# EAGLE design Xenon (EAGLE 8.0.1)
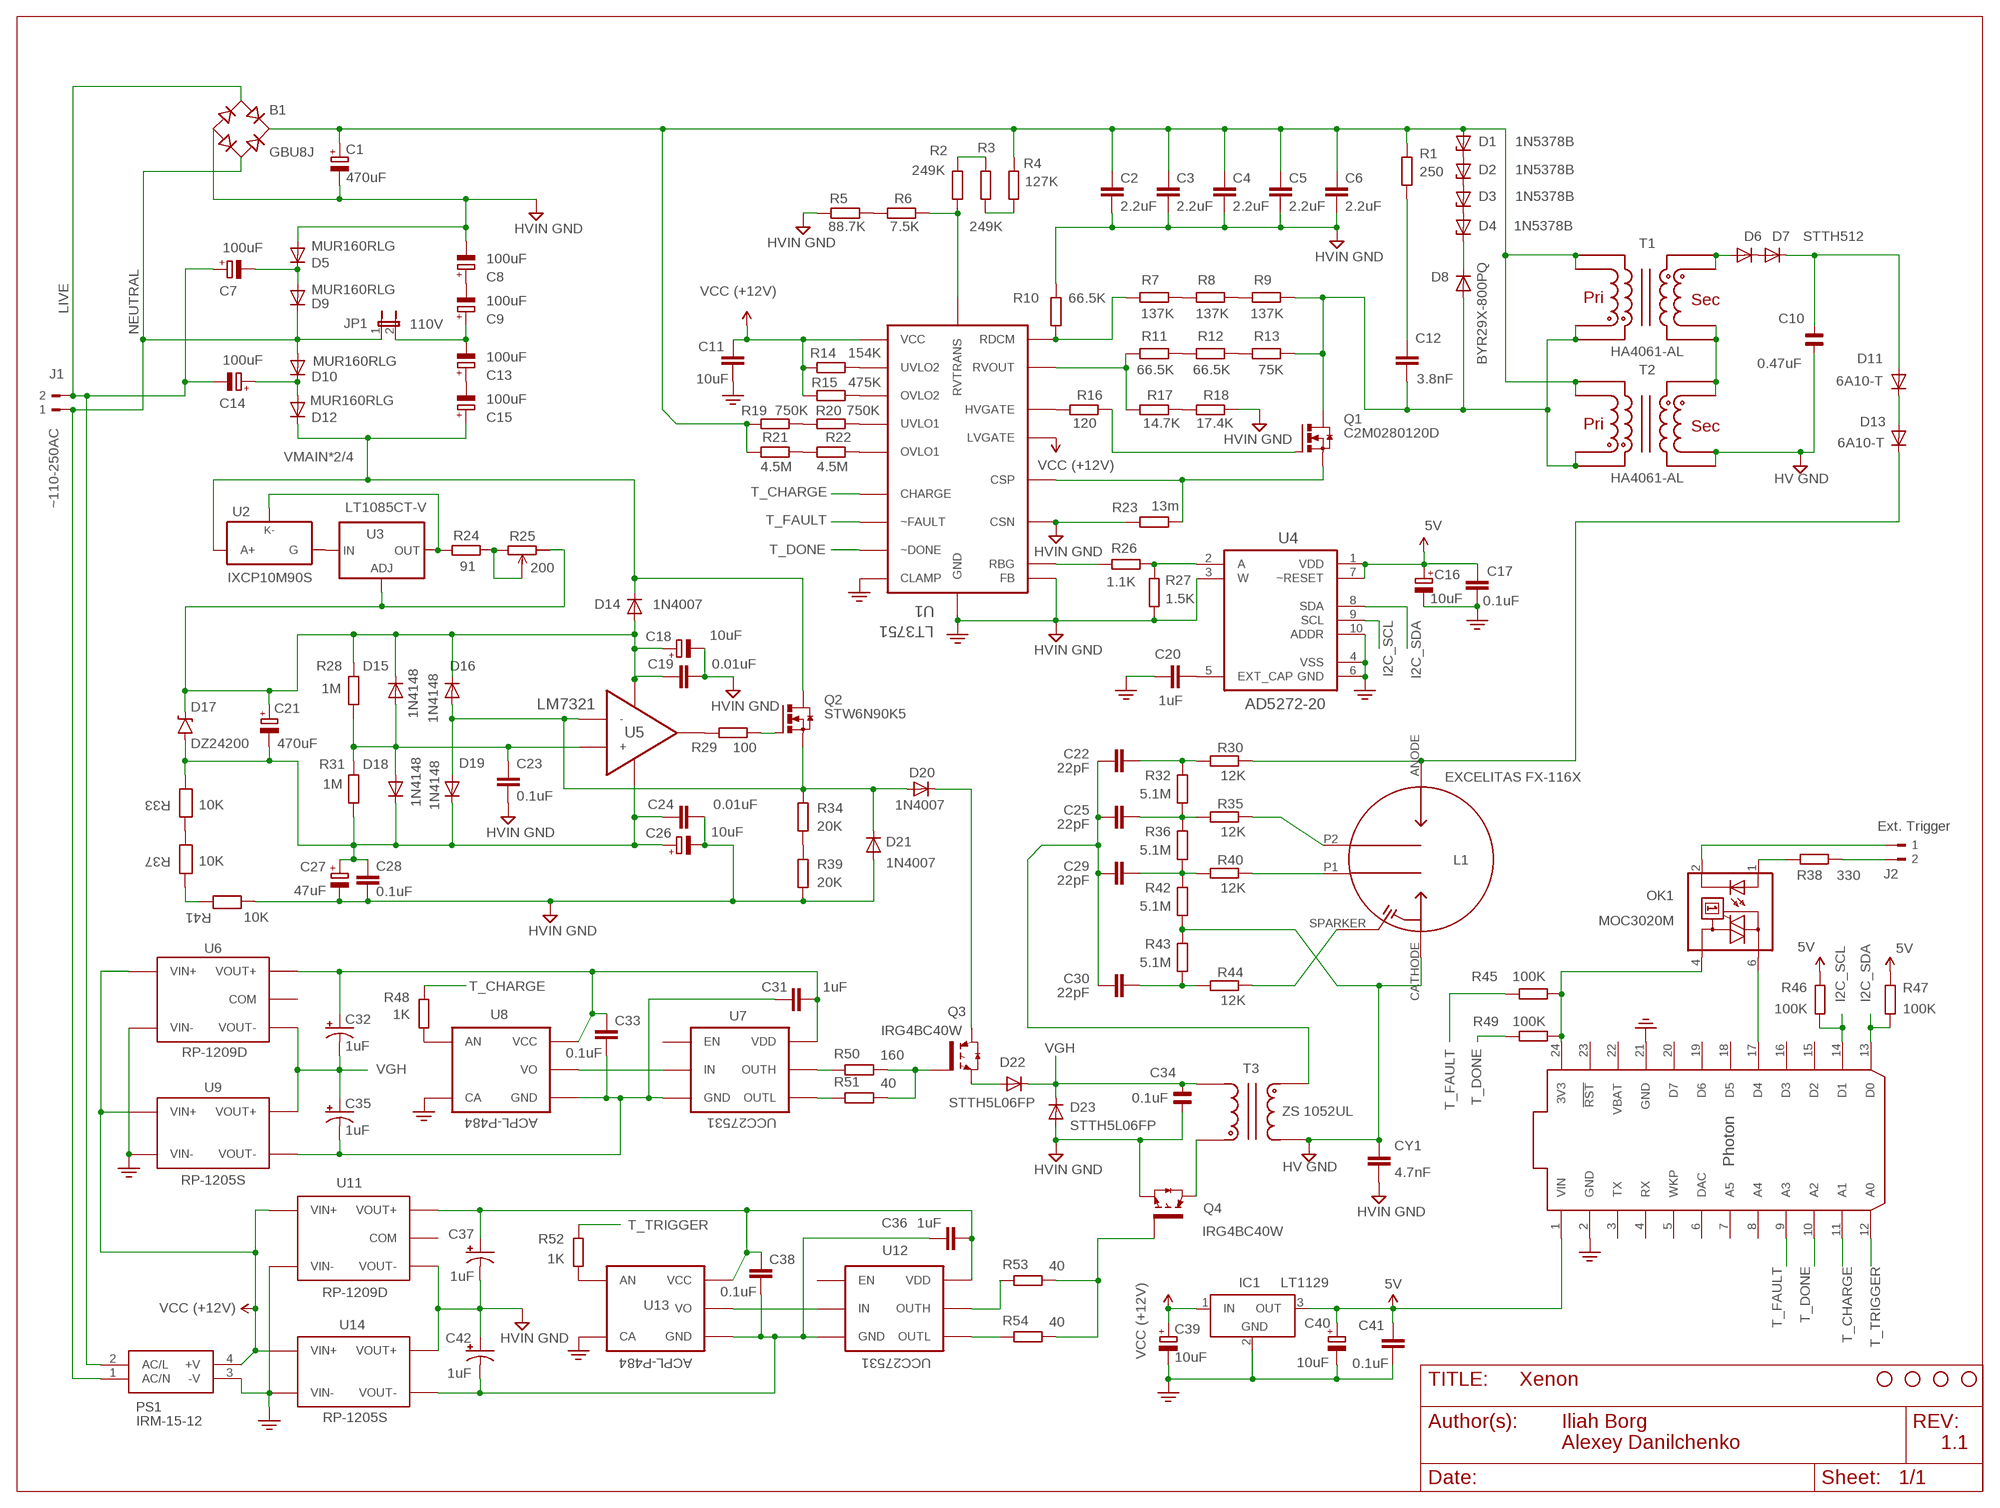
[diagram p0: schematic, sheet 1]

## Parts
B1  GBU8J  RECTIFIER-GBU4  [GBU4]
C1  470uF  CPOL-EUE10-35  [EB35D]
C2  2.2uF  C-EUC2220K  [C2220K]
C3  2.2uF  C-EUC2220K  [C2220K]
C4  2.2uF  C-EUC2220K  [C2220K]
C5  2.2uF  C-EUC2220K  [C2220K]
C6  2.2uF  C-EUC2220K  [C2220K]
C7  100uF  CPOL-EUE7.5-18  [E7,5-18]
C8  100uF  CPOL-EUE7.5-18  [E7,5-18]
C9  100uF  CPOL-EUE7.5-18  [E7,5-18]
C10  0.47uF  0,47µF  [R37K5B19]
C11  10uF  C-EUC0805  [C0805]
C12  3.8nF  C-EUC0805  [C0805]
C13  100uF  CPOL-EUE7.5-18  [E7,5-18]
C14  100uF  CPOL-EUE7.5-18  [E7,5-18]
C15  100uF  CPOL-EUE7.5-18  [E7,5-18]
C16  10uF  CPOL-EUCT3216  [CT3216]
C17  0.1uF  C-EUC0805  [C0805]
C18  10uF  CPOL-EUE5-10.5  [E5-10,5]
C19  0.01uF  C-EU050-035X075  [C050-035X075]
C20  1uF  C-EUC0805  [C0805]
C21  470uF  CPOL-EUG  [PANASONIC_G]
C22  22pF  C-EU050-030X075  [C050-030X075]
C23  0.1uF  C-EU050-035X075  [C050-035X075]
C24  0.01uF  C-EU050-035X075  [C050-035X075]
C25  22pF  C-EU050-030X075  [C050-030X075]
C26  10uF  CPOL-EUE5-10.5  [E5-10,5]
C27  47uF  CPOL-EUE5-10.5  [E5-10,5]
C28  0.1uF  C-EU050-035X075  [C050-035X075]
C29  22pF  C-EU050-030X075  [C050-030X075]
C30  22pF  C-EU050-030X075  [C050-030X075]
C31  1uF  C-EUC0805  [C0805]
C32  1uF  TANT-CAP1206  [EIA3216]
C33  0.1uF  C-EUC0805  [C0805]
C34  0.1uF  0,1µF  [R22K5B11]
C35  1uF  TANT-CAP1206  [EIA3216]
C36  1uF  C-EUC0805  [C0805]
C37  1uF  TANT-CAP1206  [EIA3216]
C38  0.1uF  C-EUC0805  [C0805]
C39  10uF  CPOL-EUCT7343  [CT7343]
C40  10uF  CPOL-EUCT7343  [CT7343]
C41  0.1uF  C-EUC0805  [C0805]
C42  1uF  TANT-CAP1206  [EIA3216]
CY1  4.7nF  CYYC10B4  [YC10B4]
D1  1N5378B  1N5333  [C1702-15]
D2  1N5378B  1N5333  [C1702-15]
D3  1N5378B  1N5333  [C1702-15]
D4  1N5378B  1N5333  [C1702-15]
D5  MUR160RLG  DIODE-DO41-10  [DO41-10]
D6  DIODE-TO220V  [TO220ACS]
D7  STTH512  DIODE-TO220V  [TO220ACS]
D8  BYR29X-800PQ  DIODE-TO220V  [TO220ACS]
D9  MUR160RLG  DIODE-DO41-10  [DO41-10]
D10  MUR160RLG  DIODE-DO41-10  [DO41-10]
D11  6A10-T  DIODE-P6-15  [P6-15]
D12  MUR160RLG  DIODE-DO41-10  [DO41-10]
D13  6A10-T  DIODE-P6-15  [P6-15]
D14  1N4007  DIODE-DO41-7.6  [DO41-7.6]
D15  1N4148  DIODE-SOD123  [SOD123]
D16  1N4148  DIODE-SOD123  [SOD123]
D17  DZ24200  DIODE-ZENERTMINIP2-F2-B  [PANASONIC_SMINI2-F5-B]
D18  1N4148  DIODE-SOD123  [SOD123]
D19  1N4148  DIODE-SOD123  [SOD123]
D20  1N4007  DIODE-DO41-7.6  [DO41-7.6]
D21  1N4007  DIODE-DO41-7.6  [DO41-7.6]
D22  STTH5L06FP  DIODE-TO220V  [TO220ACS]
D23  STTH5L06FP  DIODE-TO220V  [TO220ACS]
IC1  LT1129  LT1129CST5  [SOT223]
J1  ~110-250AC  PM5.08/2/90BLK  [WEIDMULLER_PM5.08_2]
J2  Ext. Trigger  PM5.08/2/90BLK  [WEIDMULLER_PM5.08_2]
JP1  110V  JP1E  [JP1]
L1  EXCELITAS FX-116X  EXCELITASFX-116X  [FX-116X]
OK1  MOC3020M  [DIL06]
PS1  IRM-15-12  [IRM-15-12]
Q1  C2M0280120D  IRFP240  [TO247BV]
Q2  STW6N90K5  IRFP240  [TO247BV]
Q3  IRG4BC40W  IRG4BC40WPBF  [TO220AV]
Q4  IRG4BC40W  IRG4BC40WPBF  [TO220AV]
R1  250  R-EU_R1206  [R1206]
R2  249K  R-EU_R1206  [R1206]
R3  249K  R-EU_R1206  [R1206]
R4  127K  R-EU_R1206  [R1206]
R5  88.7K  R-EU_R0805  [R0805]
R6  7.5K  R-EU_R0805  [R0805]
R7  137K  R-EU_R1206  [R1206]
R8  137K  R-EU_R1206  [R1206]
R9  137K  R-EU_R1206  [R1206]
R10  66.5K  R-EU_R0805  [R0805]
R11  66.5K  R-EU_R1206  [R1206]
R12  66.5K  R-EU_R1206  [R1206]
R13  75K  R-EU_R1206  [R1206]
R14  154K  R-EU_R0805  [R0805]
R15  475K  R-EU_R0805  [R0805]
R16  120  R-EU_R0805  [R0805]
R17  14.7K  R-EU_R0805  [R0805]
R18  17.4K  R-EU_R0805  [R0805]
R19  750K  R-EU_R1206  [R1206]
R20  750K  R-EU_R1206  [R1206]
R21  4.5M  R-EU_R1206  [R1206]
R22  4.5M  R-EU_R1206  [R1206]
R23  13m  R-EU_R1206  [R1206]
R24  91  R-EU_R1206  [R1206]
R25  200  R-TRIMMT93YA  [RTRIMT93YA]
R26  1.1K  R-EU_R0805  [R0805]
R27  1.5K  R-EU_R0805  [R0805]
R28  1M  R-EU_R1206  [R1206]
R29  100  R-EU_R1206  [R1206]
R30  12K  R-EU_0207/10  [0207/10]
R31  1M  R-EU_R1206  [R1206]
R32  5.1M  R-EU_0207/10  [0207/10]
R33  10K  WHE10KFET  [RES_WH/NE]
R34  20K  R-EU_0309/10  [0309/10]
R35  12K  R-EU_0207/10  [0207/10]
R36  5.1M  R-EU_0207/10  [0207/10]
R37  10K  WHE10KFET  [RES_WH/NE]
R38  330  R-EU_R0805  [R0805]
R39  20K  R-EU_0309/10  [0309/10]
R40  12K  R-EU_0207/10  [0207/10]
R41  10K  WHE10KFET  [RES_WH/NE]
R42  5.1M  R-EU_0207/10  [0207/10]
R43  5.1M  R-EU_0207/10  [0207/10]
R44  12K  R-EU_0207/10  [0207/10]
R45  100K  R-EU_R0805  [R0805]
R46  100K  R-EU_R0805  [R0805]
R47  100K  R-EU_R0805  [R0805]
R48  1K  R-EU_R1206  [R1206]
R49  100K  R-EU_R0805  [R0805]
R50  160  R-EU_R2512  [R2512]
R51  40  R-EU_R2512  [R2512]
R52  1K  R-EU_R1206  [R1206]
R53  40  R-EU_R2512  [R2512]
R54  40  R-EU_R2512  [R2512]
STANDOFF1  STAND-OFF  [STAND-OFF]
STANDOFF2  STAND-OFF  [STAND-OFF]
STANDOFF3  STAND-OFF  [STAND-OFF]
STANDOFF4  STAND-OFF  [STAND-OFF]
T1  HA4061-AL  [HA4061-AL]
T2  HA4061-AL  [HA4061-AL]
T3  ZS 1052UL  ZS1052H  [ZS1052H]
U1  LT3751  [SOP65P640X120-21N]
U2  IXCP10M90S  [TO254P482X1016X2386-3P]
U3  LT1085CT-V  [TO220S]
U4  AD5272-20  AD5272BRMZ-20  [SOP50P490X110-10N]
U5  LM7321  LM7321SOT23-5  [SOT95P280X145-5N]
U6  RP-1209D  RECOM-DUAL  [RECOM-DUAL]
U7  UCC27531  [SOT95P280X145-6N]
U8  ACPL-P484  [SOIC6-W]
U9  RP-1205S  RECOM-SINGLE  [RECOM-SINGLE]
U10  PHOTON_WITH_HEADERS  [PHOTON]
U11  RP-1209D  RECOM-DUAL  [RECOM-DUAL]
U12  UCC27531  [SOT95P280X145-6N]
U13  ACPL-P484  [SOIC6-W]
U14  RP-1205S  RECOM-SINGLE  [RECOM-SINGLE]

## Nets
5V: C16.-(+) C17.1 C40.+ C41.1 IC1.3(OUT) R46.2 R47.2 U4.1(VDD) U4.7(~RESET) U10.1(VIN)
GND: C11.2 C16.+(-) C17.2 C20.1 C39.- C40.- C41.2 IC1.2(GND) PS1.3(-V) R27.1 U1.9(CLAMP) U1.10(FB) U1.21(GND) U4.3(W) U4.4(VSS) U4.6(GND) U4.10(ADDR) U6.P$2(VIN-) U8.3(CA) U9.P$2(VIN-) U10.2(GND) U10.21(GND) U11.P$2(VIN-) U13.3(CA) U14.P$2(VIN-) ; supply symbol labelled HVIN GND
GND1: C10.2 CY1.1 L1.CATHODE R42.1 R43.2 T2.P5 T2.P6 T3.P3(S-S) ; supply symbol labelled HV GND
GND2: C18.- C19.2 C23.2 C24.2 C26.- C27.- C28.2 C34.2 C37.C(-) C42.A(+) CY1.2 D21.A D23.A Q4.3(E) R5.1 R18.2 R23.1 R39.1 R41.1 U1.11(CSN) U11.P$5(VOUT-) U14.P$7(VOUT+) ; supply symbol labelled HVIN GND
I2C_SCL: R46.1 U4.9(SCL) U10.14(D1)
I2C_SDA: R47.1 U4.8(SDA) U10.13(D0)
IGND1: C31.1 C33.2 C35.C(-) U7.4(GND) U8.4(GND) U9.P$5(VOUT-)
LIVE: B1.AC1 C7.+ C14.- J1.2 PS1.2(AC/L)
N$1: C10.1 D7.C D11.A
N$2: R5.2 R6.1
N$3: R50.1 U7.6(OUTH)
N$4: Q3.1(G) R50.2 R51.2
N$5: D13.C L1.ANODE R30.2
N$6: C12.2 D8.A Q1.D R9.2 R13.2 T1.P1 T1.P2 T2.P1 T2.P2
N$7: R51.1 U7.5(OUTL)
N$8: R54.1 U12.5(OUTL)
N$9: T1.P5 T1.P6 T2.P7 T2.P8
N$10: D6.A T1.P7 T1.P8
N$11: OK1.4(A1) R45.1 R49.1 U10.24(3V3)
N$12: R53.1 U12.6(OUTH)
N$13: Q4.1(G) R53.2 R54.2
N$14: U2.1(G) U3.3(IN)
N$15: L1.SPARKER R44.2
N$16: U12.2(IN) U13.5(VO)
N$17: D22.A Q3.3(E)
N$18: R52.1 U13.1(AN)
N$19: U7.2(IN) U8.5(VO)
N$20: C22.1 C25.1 C29.1 C30.1 T3.P4(S-P)
N$21: C36.1 C38.2 C42.C(-) U12.4(GND) U13.4(GND) U14.P$5(VOUT-)
N$22: C30.2 R43.1 R44.1
N$23: C29.2 R36.1 R40.1 R42.2
N$24: C25.2 R32.1 R35.1 R36.2
N$25: C22.2 R30.1 R32.2
N$26: L1.P2 R35.2
N$27: C31.2 C32.A(+) C33.1 U6.P$7(VOUT+) U7.3(VDD) U8.6(VCC)
N$28: L1.P1 R40.2
N$29: D6.C D7.A
N$30: OK1.1(A) R38.2
N$31: OK1.6(A2) U10.17(D4)
N$32: J2.2 R38.1
N$33: J2.1 OK1.2(C)
N$34: C36.2 C37.A(+) C38.1 U11.P$7(VOUT+) U12.3(VDD) U13.6(VCC)
N$35: Q4.2(C) T3.P2(P-P)
N$36: R48.1 U8.1(AN)
N$37: R24.1 U2.3(K-) U3.2(OUT)
N$38: R33.2 R37.1
N$39: R37.2 R41.2
N$40: C21.- C24.1 C26.+ C27.+ C28.1 D17.A D18.C D19.C R31.1 R33.1 U5.2(-VS)
N$41: C7.- D5.C D9.A
N$42: R24.2 R25.2(S) R25.3(A)
N$43: C23.1 D15.A D18.A R28.1 R31.2 U5.3(+)
N$44: D16.A D19.A D20.A D21.C Q2.S R34.2 U5.4(-)
N$45: R3.1 R4.1
N$46: R34.1 R39.2
N$47: R29.1 U5.1(VOUT)
N$48: Q2.G R29.2
N$49: R7.2 R8.1
N$52: R20.2 U1.2(UVLO1)
N$53: R19.2 R20.1
N$54: R22.2 U1.3(OVLO1)
N$55: R21.2 R22.1
N$56: B1.+ C1.+ C2.1 C3.1 C4.1 C5.1 C6.1 D1.A R1.2 R4.2 R19.1 R21.1 T1.P11 T1.P12 T2.P11 T2.P12
N$57: R14.2 U1.4(UVLO2)
N$58: R15.2 U1.5(OVLO2)
N$59: R2.2 R3.2
N$60: R2.1 R6.2 U1.1(RVTRANS)
N$61: Q1.S R23.2 U1.12(CSP)
N$62: R17.2 R18.1
N$63: R16.1 U1.15(HVGATE)
N$64: Q1.G R16.2
N$65: R7.1 R10.1 U1.20(RDCM)
N$66: R8.2 R9.1
N$67: R26.1 R27.2 U4.2(A)
N$68: R11.1 R17.1 U1.18(RVOUT)
N$69: R11.2 R12.1
N$70: R12.2 R13.1
N$71: C13.+ C15.-
N$72: C20.2 U4.5(EXT_CAP)
N$73: R26.2 U1.16(RBG)
N$74: C18.+ C19.1 C21.+ D14.A D15.C D16.C D17.C R25.1(E) R28.2 U3.1(ADJ) U5.5(+VS)
N$75: C14.+ D10.C D12.A
N$76: C9.+ C13.- JP1.2
N$77: C8.+ C9.-
N$78: D11.C D13.A
N$79: D1.C D2.A
N$80: D2.C D3.A
N$81: D3.C D4.A
N$82: D4.C D8.C
N$83: C12.1 R1.1
NEUTRAL: B1.AC2 D9.C D10.A J1.1 JP1.1 PS1.1(AC/N)
T_CHARGE: R48.2 U1.8(CHARGE) U10.11(A1)
T_DONE: R49.2 U1.7(~DONE) U10.10(A2)
T_FAULT: R45.2 U1.6(~FAULT) U10.9(A3)
T_TRIGGER: R52.2 U10.12(A0)
TR_GND: B1.- C1.- C2.2 C3.2 C4.2 C5.2 C6.2 C8.- D5.A R10.2 ; supply symbol labelled HVIN GND
VDD: C11.1 C39.+ IC1.1(IN) PS1.4(+V) R14.1 R15.1 U1.13(VCC) U1.14(LVGATE) U6.P$1(VIN+) U9.P$1(VIN+) U11.P$1(VIN+) U14.P$1(VIN+) ; supply symbol labelled VCC (+12V)
VGH: C32.C(-) C34.1 C35.A(+) D22.C D23.C T3.P1(P-S) U6.P$5(VOUT-) U9.P$7(VOUT+)
VMAIN*2/4: C15.+ D12.C D14.C Q2.D U2.2(A+)
VTRG: D20.C Q3.2(C)
Unconnected: U7.1(EN) U10.3(TX) U10.4(RX) U10.5(WKP) U10.6(DAC) U10.7(A5) U10.8(A4) U10.15(D2) U10.16(D3) U10.18(D5) U10.19(D6) U10.20(D7) U10.23(!RST) U12.1(EN)

## Notes on the sheet
- Iliah Borg
  Alexey Danilchenko
- 1.1

## Power pins joined to a net without a drawn wire
COM: U6.P$6(COM) U11.P$6(COM)
GND: IC1.4(GND)
VBAT: U10.22(VBAT)

## Library data of the parts
B1 = rectifier:RECTIFIER-: Rectifier
C1 C7-C9 C13-C15 C18 C21 C26 C27 = rcl:CPOL-EU: POLARIZED CAPACITOR, European symbol
C2-C6 C19 C22-C25 C28-C30 = rcl:C-EU: CAPACITOR, European symbol
C10 = Capacitor-Wima-MKP10-1600v:0,47µF
C11 C12 C31 C33 C36 C38 C41 = Spectron2:C-EU: CAPACITOR, European symbol
C16 = resistor:CPOL-EU: POLARIZED CAPACITOR, European symbol
C17 = resistor:C-EU: CAPACITOR, European symbol
C20 = Spectron:C-EU: CAPACITOR, European symbol
C32 C35 C37 C42 = Spectron2:TANT-CAP: Tantalum SMT
C34 = Capacitor-Wima-MKP10-1600v:0,1µF
C39 C40 = Spectron:CPOL-EU: POLARIZED CAPACITOR, European symbol
CY1 = rcl:CY: Y CAPACITOR for power line
D1-D4 = diode:1N5333: Z DIODE 3.3 V, 5W, 5 percent (Motorola)
D5-D7 D9-D16 D18-D21 = diode:DIODE-: DIODE
D8 D22 D23 = Spectron:DIODE-: DIODE
D17 = SparkFun-DiscreteSemi:DIODE-ZENER: Zener Diode Production Part - 8199 3.4V Zener Voltage; PROD_ID: DIO-12989
IC1 = linear-technology-3:LT1129CST5: VOLTAGE REGULATOR with shutdown
J1 J2 = WEIDMULLER-PM5.08_2_90BLK:PM5.08/2/90BLK: TERMINAL BLOCK, SIDE ENTRY, 2WAY; MPN: PM5.08/2/90 BLK; OC_FARNELL: 1131855; OC_NEWARK: 26M1980; PACKAGE: TH-R/A; SUPPLIER: WEIDMULLER
JP1 = jumper:JP1E: JUMPER
L1 = Xenon:EXCELITAS: Excelitas (Perkin Elmer) Xenon pulsed flash - FX-116x series
OK1 = optocoupler:MOC30*M: RANDOM-PHASE OPTOISOLATORS TRIAC DRIVER OUTPUT Source: http://www.fairchildsemi.com MOC3020-M.pdf; MF: FAIRCHILD SEMICONDUCTOR; MPN: MOC3020-M; OC_FARNELL: 1505425; OC_NEWARK: 72K8895
PS1 = IRM-15-12:IRM-15-12: AC/DC Power Modules 12V 1.25A 15W 85-264Vin Encap PS Source: Datasheet <https://www.meanwell-web.com/content/files/pdfs/productPdfs/MW/IRM-15-spec.pdf>; DESCRIPTION: AC/DC Power Modules 12V 1.25A 15W 85-264Vin Encap PS; HEIGHT: mm; MANUFACTURER_NAME: Mean Well; MANUFACTURER_PART_NUMBER: IRM-15-12; RS_PART_NUMBER: 1358936; RS_PRICE/STOCK: http://uk.rs-online.com/web/p/products/1358936
Q1 Q2 = transistor-power:IRFP240: HEXFET Power MosFet Source: http://www.irf.com/
Q3 Q4 = Xenon:IRG4BC40WPBF: INSULATED GATE BIPOLAR TRANSISTOR WITH ULTRAFAST SOFT RECOVERY DIODE
R1-R4 R7-R9 R11-R13 R19-R24 R28 R29 R31 R34 R39 R50 R51 R53 R54 = rcl:R-EU_: RESISTOR, European symbol
R5 R6 R10 R14-R18 R26 R27 R30 R32 R35 R36 R38 R40 R42-R47 R49 = resistor:R-EU_: RESISTOR, European symbol
R25 = rcl:R-TRIMM: Trimm resistor
R33 R37 R41 = Xenon:WHE10KFET; MANUFACTURER_PART_NUMBER: WHE10KFET; VENDOR: Ohmite
R48 R52 = Spectron2:R-EU_: RESISTOR, European symbol
STANDOFF1-STANDOFF4 = Spectron2:STAND-OFF: #4 Stand Off This is the mechanical footprint for a #4 phillips button head screw. Use the keepout ring to avoid running the screw head into surrounding components. SKU : PRT-00447
T1 T2 = Xenon:HA4061-AL
T3 = Xenon:ZS1052H
U1 = Xenon:LT3751: High Voltage Capacitor Charger Controller with Regulation; AVAILABILITY: Good; DESCRIPTION: LT3751 Capacitor Charge Control TSSOP-20; MF: Linear Technology; MP: LT3751EFE#PBF; PACKAGE: TSSOP-20 Linear Technology; PRICE: 5.83 USD
U2 = IXCP10M90S:IXCP10M90S: Current & Power Monitors & Regulators 900V 1-100mA Source: Datasheet <http://www.mouser.com/ds/2/205/98729-63438.pdf>; DESCRIPTION: Current & Power Monitors & Regulators 900V 1-100mA; HEIGHT: 4.82mm; MANUFACTURER_NAME: IXYS SEMICONDUCTOR; MANUFACTURER_PART_NUMBER: IXCP10M90S; SUPPLIER_NAME: RS
U3 = linear-technology-3:LT1085*: 3A Low Dropout Positive Adjustable Regulators
U4 = Analog Devices_By_element14_Batch_1:AD5272BRMZ-20: 1024-/256-Position, 1% Resistor Tolerance Error, I2C Interface and 50-TP Memory Digital Rheostat; MPN: AD5272BRMZ-20; OC_FARNELL: 1827322; OC_NEWARK: 52R8114; PACKAGE: MSOP-10; SUPPLIER: Analog Devices
U5 = Xenon:LM7321: Amplifiers; PACKAGE: SOT23-5
U6 U11 = Xenon:RECOM-DUAL: Recom Power RP series DC/DC isolated convertors
U7 U12 = Xenon:UCC27531: Single-channel, high-speed gate driver; PACKAGE: SOT-23-6; SUPPLIER: Texas Instruments
U8 U13 = Xenon:ACPL-P484: Single-channel, high-speed gate driver
U9 U14 = Xenon:RECOM-SINGLE: Recom Power RP series DC/DC isolated convertors
U10 = Spectron2:PHOTON

## Board
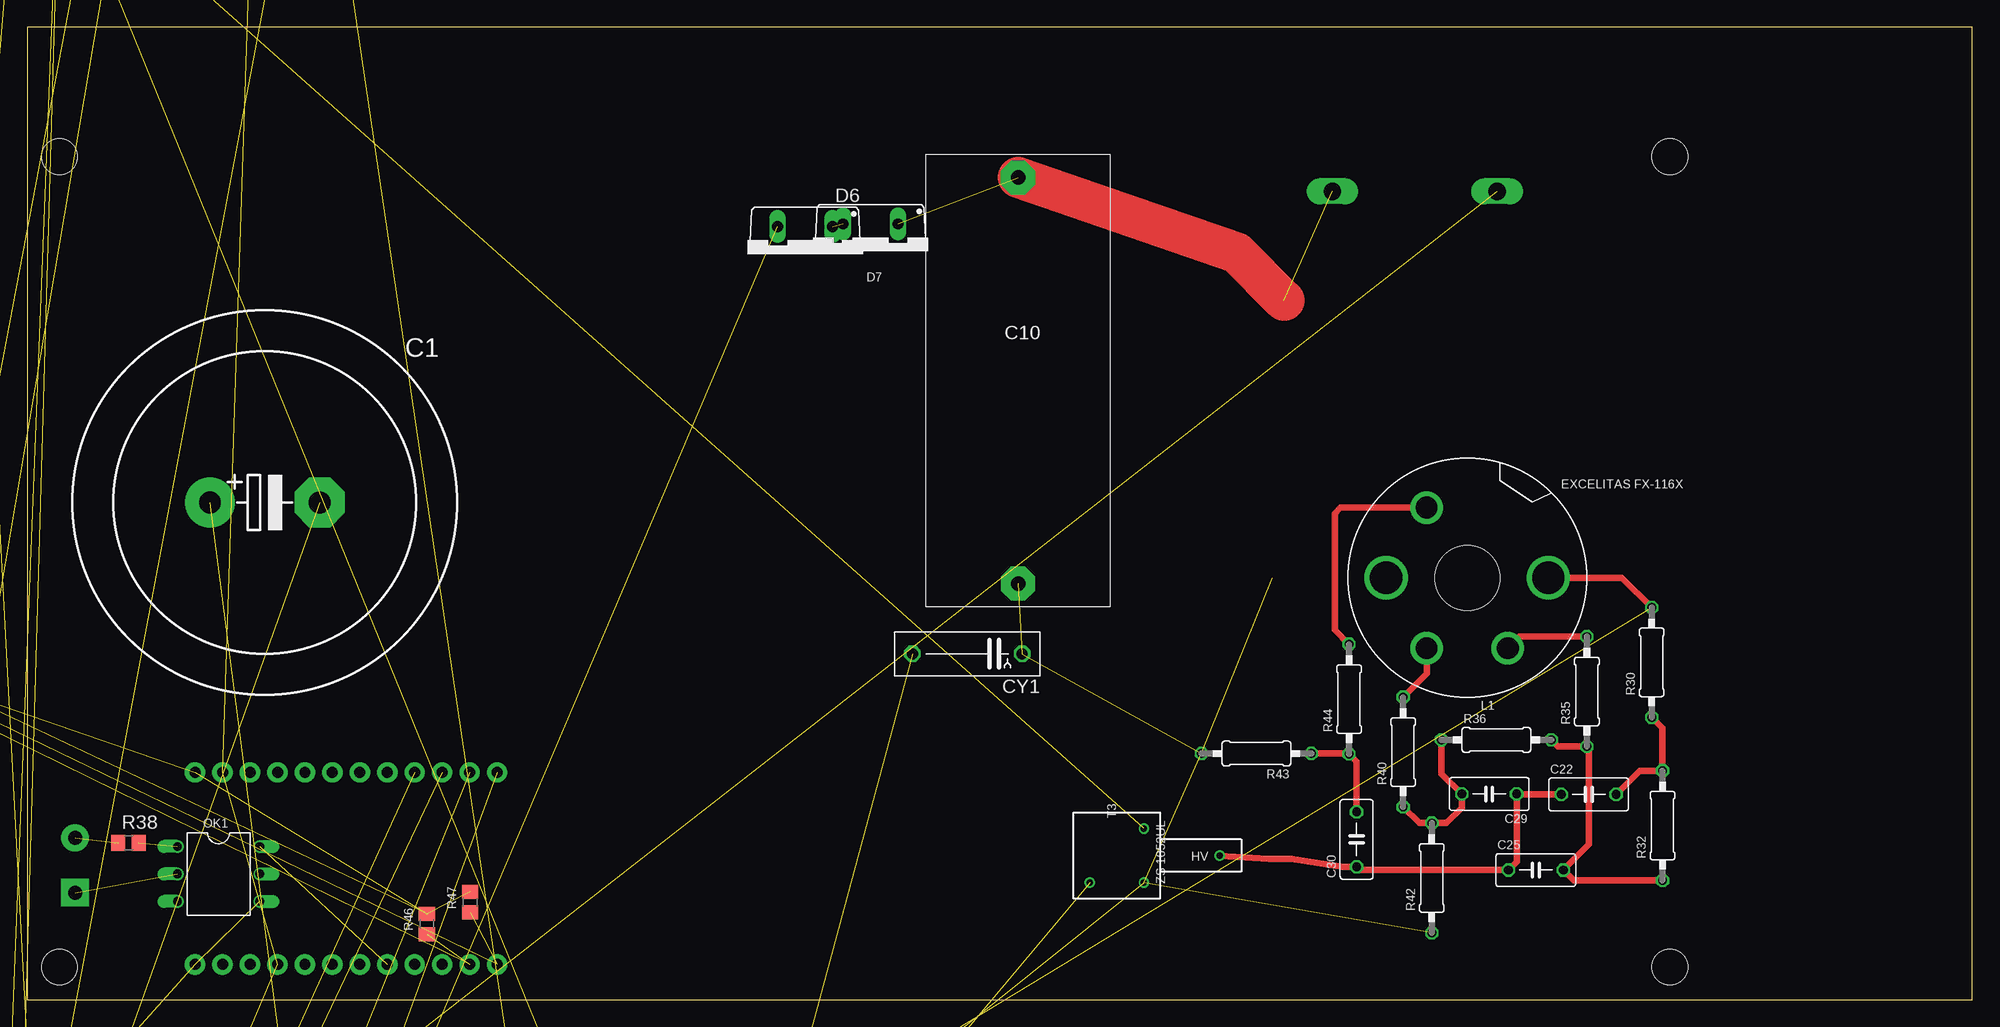
[diagram p1: board, top side]
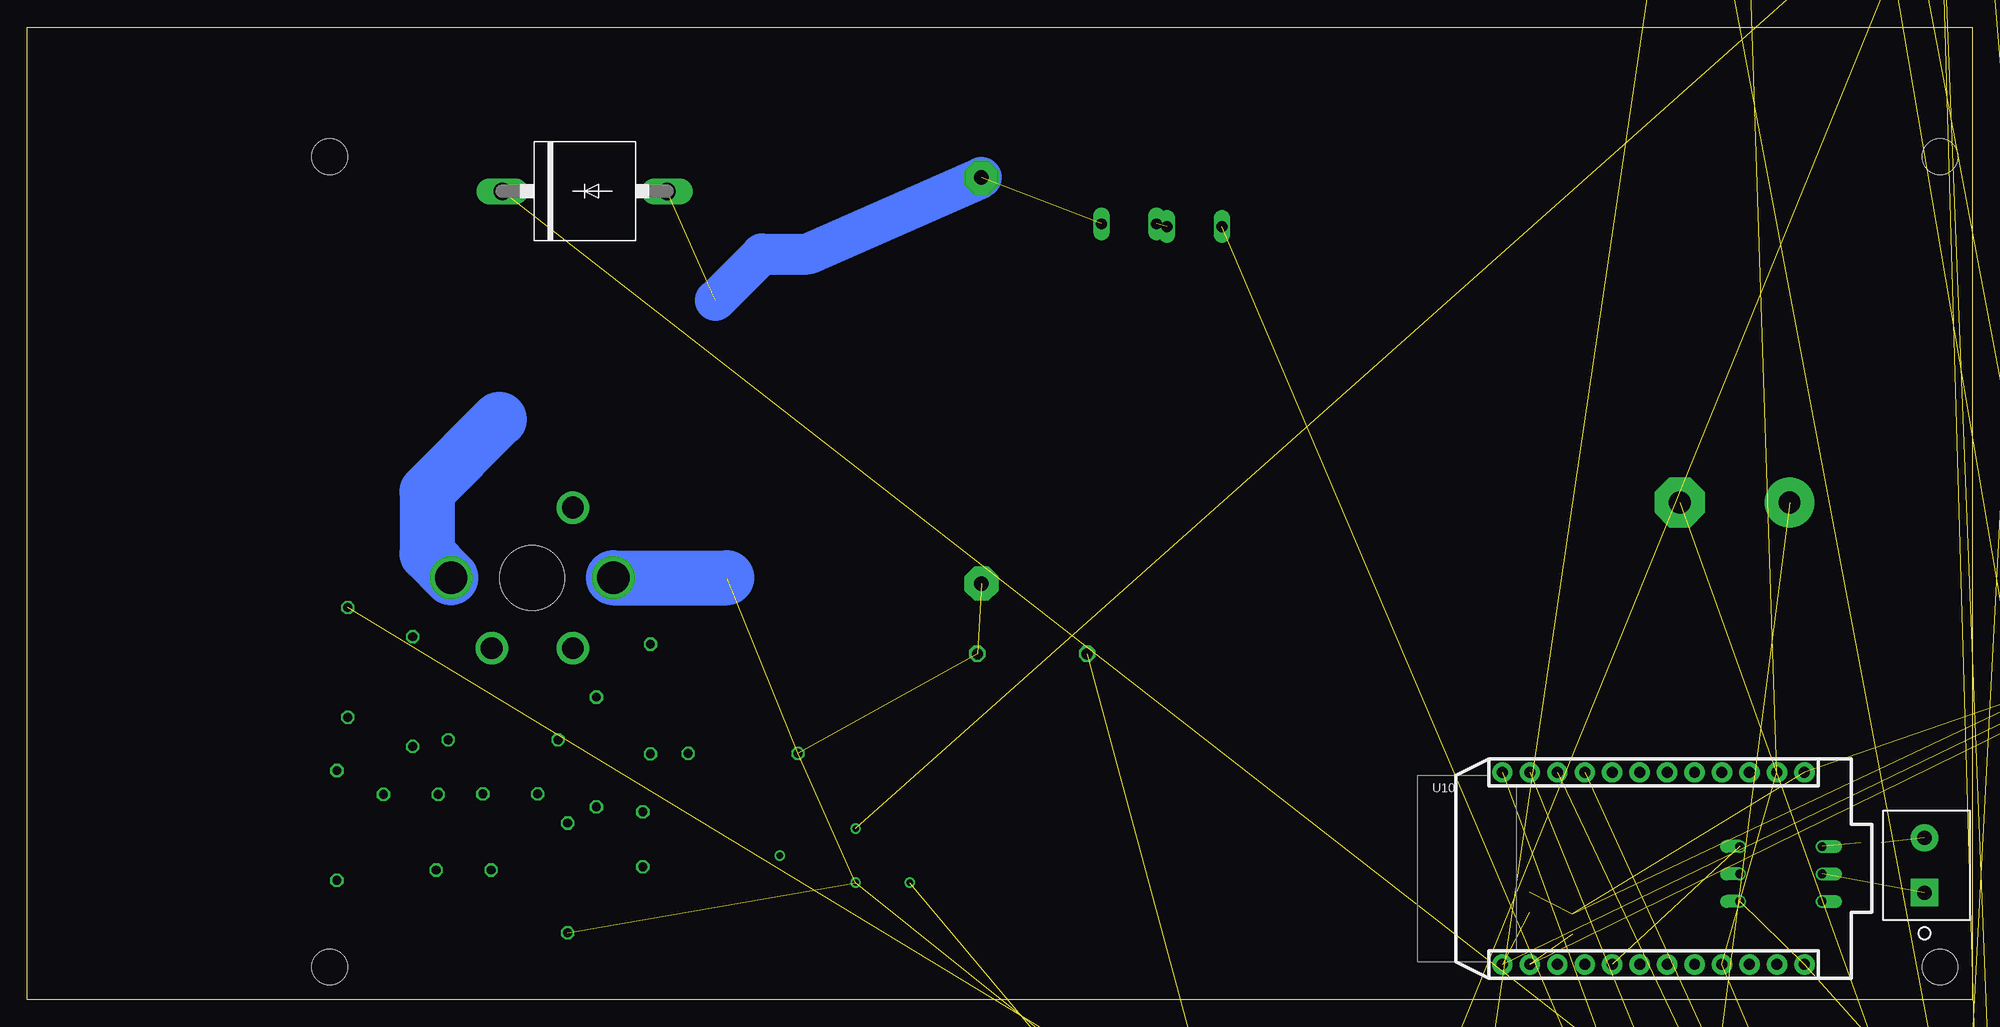
[diagram p2: board, bottom side, seen from below]

Size 180 x 90 mm. Coordinates in mm from the lower left corner, seen from the top.
Outline: 0,0 180,0 180,90 0,90 0,0
Copper layers (1*16): Top 0.0356mm / dielectric 1.5011mm / Bottom 0.0356mm
Design rules "oshpark-2layer *": minimum track width 6mil, minimum drill 13mil, track to track 8mil, track to pad 8mil, pad to pad 8mil, via to via 8mil, smd to smd 0mil, copper to edge 15mil, drill to drill 6mil, minimum pad ring 7mil, minimum via ring 7mil, stop-mask expansion 2.5mil, vias tented up to drill 0mil, thermal gap 10mil

### Footprints (pad centres in the part's own frame; a part is rotated, then mirrored left to right if it is on the bottom)
GBU4 = drill 1.499 long: + 7.62,0; - -7.62,0; AC1 2.54,0; AC2 -2.54,0
EB35D = drill 2.007 pad 4.597: + -5.08,0 | drill 2.007 pad 4.597 octagon: - 5.08,0
C2220K = smd 1.85 x 5.5: 1 -2.55,0; 2 2.55,0
E7,5-18 = drill 1.016 pad 3.15: + -3.81,0 | drill 1.016 pad 3.15 octagon: - 3.81,0
R37K5B19 = drill 1.321 pad 3.15 octagon: 1 -18.796,0; 2 18.796,0
C0805 = smd 1.3 x 1.5: 1 -0.95,0; 2 0.95,0
CT3216 = smd 2 x 1.2: + -1.4,0; - 1.4,0
E5-10,5 = drill 1.016 pad 2.54: + -2.54,0 | drill 1.016 pad 2.54 octagon: - 2.54,0
C050-035X075 = drill 0.813 octagon: 1 -2.54,0; 2 2.54,0
C0805' = smd 1.3 x 1.5: 1 -0.85,0; 2 0.85,0
PANASONIC_G = smd 3.9 x 1.6: + 4.25,0; - -4.25,0
C050-030X075 = drill 0.813 octagon: 1 -2.54,0; 2 2.54,0
EIA3216 = smd 1.4 x 1.6: A 1.4,0; C -1.4,0
R22K5B11 = drill 1.016 pad 2.54 octagon: 1 -11.303,0; 2 11.303,0
CT7343 = smd 2.6 x 2.4: + -3.2,0; - 3.2,0
YC10B4 = drill 1.016 octagon: 1 -5.08,0; 2 5.08,0
C1702-15 = drill 1.397 long: A 7.62,0; C -7.62,0
DO41-10 = drill 1.118: A 5.08,0; C -5.08,0
TO220ACS = drill 1.016 long: A 2.54,-2.54; C -2.54,-2.54
P6-15 = drill 1.6 long: A 7.62,0; C -7.62,0
DO41-7.6 = drill 1.1 pad 1.7: A 3.81,0; C -3.81,0
SOD123 = smd 1.4 x 1.4: A 1.9,0; C -1.9,0
PANASONIC_SMINI2-F5-B = smd 1.4 x 2.1: A 2.2,0; C -2.4,0
SOT223 = smd 1.219 x 2.235: 1 -2.311,-3.099; 2 0,-3.099; 3 2.311,-3.099 | smd 3.6 x 2.2: 4 0,3.099
WEIDMULLER_PM5.08_2 = drill 1.3 pad 2.54 square: 1 -2.54,0 | drill 1.3 pad 2.54: 2 2.54,0
JP1 = drill 0.914 long: 1 0,-1.27; 2 0,1.27
FX-116X = drill 3: ANODE -7.5,0; CATHODE 7.5,0 | drill 2: P1 3.75,6.5; P2 -3.75,6.5; SPARKER 3.75,-6.5 | hole 6: 0,0
DIL06 = drill 0.813 offset: 1 -2.54,-3.81; 2 0,-3.81; 3 2.54,-3.81; 4 2.54,3.81; 5 0,3.81; 6 -2.54,3.81
IRM-15-12 = drill 1.04 pad 1.6: 1 3.4,24; 2 3.4,3.2; 3 48.4,3.2; 4 48.4,11.2
TO247BV = drill 1.499 long: D 0,-2.921; G -5.588,-2.921; S 5.588,-2.921
TO220AV = drill 1.016 long: 1 -2.54,-2.54; 2 0,-2.54; 3 2.54,-2.54
R1206 = smd 1.6 x 1.803: 1 -1.422,0; 2 1.422,0
R0805 = smd 1.3 x 1.5: 1 -0.95,0; 2 0.95,0
RTRIMT93YA = drill 0.61: 1 0,-2.54; 2 0,0; 3 0,2.54
0207/10 = drill 0.813 octagon: 1 -5.08,0; 2 5.08,0
RES_WH/NE = drill 1.245 pad 1.753 square: 1 -27.94,0 | drill 1.245 pad 1.753: 2 0,0
0309/10 = drill 0.813 octagon: 1 -5.08,0; 2 5.08,0
R2512 = smd 1.8 x 3.2: 1 -2.8,0; 2 2.8,0
STAND-OFF = hole 3.302: 0,0
HA4061-AL = drill 1.016: P1 -12.7,11.43; P2 -12.7,7.62; P3 -12.7,3.81; P4 -12.7,-3.81; P5 -12.7,-7.62; P6 -12.7,-11.43; P7 12.7,-11.43; P8 12.7,-7.62; P9 12.7,-3.81; P10 12.7,3.81; P11 12.7,7.62; P12 12.7,11.43
ZS1052H = drill 0.6: P1 2.5,2.5; P2 -2.5,-2.5; P3 2.5,-2.5; P4 9.5,0
SOP65P640X120-21N = smd 1.473 x 0.356: 1 -2.819,2.921; 2 -2.819,2.286; 3 -2.819,1.626; 4 -2.819,0.965; 5 -2.819,0.33; 6 -2.819,-0.33; 7 -2.819,-0.965; 8 -2.819,-1.626; 9 -2.819,-2.286; 10 -2.819,-2.921; 11 2.819,-2.921; 12 2.819,-2.286; 13 2.819,-1.626; 14 2.819,-0.965; 15 2.819,-0.33; 16 2.819,0.33; 17 2.819,0.965; 18 2.819,1.626; 19 2.819,2.286; 20 2.819,2.921 | smd 2.743 x 4.953: 21 0,0
TO254P482X1016X2386-3P = drill 1.37 pad 2.055 square: 1 0,0 | drill 1.37 pad 2.055: 2 2.54,0; 3 5.08,0
TO220S = drill 1.016 long: 1 -2.54,-2.54; 2 0,-2.54; 3 2.54,-2.54
SOP50P490X110-10N = smd 1.422 x 0.305: 1 -2.184,0.991; 2 -2.184,0.508; 3 -2.184,0; 4 -2.184,-0.508; 5 -2.184,-0.991; 6 2.184,-0.991; 7 2.184,-0.508; 8 2.184,0; 9 2.184,0.508; 10 2.184,0.991
SOT95P280X145-5N = smd 1.321 x 0.559: 1 -1.168,0.94; 2 -1.168,0; 3 -1.168,-0.94; 4 1.168,-0.94; 5 1.168,0.94
RECOM-DUAL = drill 0.7 pad 1.676: P$1 -7.62,2.54; P$2 -5.08,2.54; P$5 2.54,2.54; P$6 5.08,2.54; P$7 7.62,2.54
SOT95P280X145-6N = smd 1.27 x 0.559: 1 -1.295,0.94; 2 -1.295,0; 3 -1.295,-0.94; 4 1.295,-0.94; 5 1.295,0; 6 1.295,0.94
SOIC6-W = smd 1.905 x 0.762: 1 -5.004,1.397; 2 -5.004,0.127; 3 -5.004,-1.143; 4 5.512,-1.143; 5 5.512,0.127; 6 5.512,1.397
RECOM-SINGLE = drill 0.7 pad 1.676: P$1 -7.62,2.54; P$2 -5.08,2.54; P$5 2.54,2.54; P$7 7.62,2.54
PHOTON = drill 1.016 pad 1.88: 1 1.27,32.258; 2 1.27,29.718; 3 1.27,27.178; 4 1.27,24.638; 5 1.27,22.098; 6 1.27,19.558; 7 1.27,17.018; 8 1.27,14.478; 9 1.27,11.938; 10 1.27,9.398; 11 1.27,6.858; 12 1.27,4.318; 13 19.05,4.318; 14 19.05,6.858; 15 19.05,9.398; 16 19.05,11.938; 17 19.05,14.478; 18 19.05,17.018; 19 19.05,19.558; 20 19.05,22.098; 21 19.05,24.638; 22 19.05,27.178; 23 19.05,29.718; 24 19.05,32.258

### Placement (x,y rotation side)
B1  -94,-314 0 top  (outside the outline)
C1  22,46 0 top
C2  -247,55 0 top  (outside the outline)
C3  -255,55 0 top  (outside the outline)
C4  -263,55 0 top  (outside the outline)
C5  -271,55 0 top  (outside the outline)
C6  -279,55 0 top  (outside the outline)
C7  -182,-23 0 top  (outside the outline)
C8  -182,-151 0 top  (outside the outline)
C9  -182,-119 0 top  (outside the outline)
C10  91.7,57.28 270 top
C11  -280,0 0 top  (outside the outline)
C12  -221,-295 0 top  (outside the outline)
C13  -182,-87 0 top  (outside the outline)
C14  -182,9 0 top  (outside the outline)
C15  -182,-55 0 top  (outside the outline)
C16  -197,110 0 top  (outside the outline)
C17  -190,110 0 top  (outside the outline)
C18  -98,-153 0 top  (outside the outline)
C19  -105,-134 0 top  (outside the outline)
C20  1uF  [C0805']  -200,97 0 top  (outside the outline)
C21  -83,108 0 top  (outside the outline)
C22  144.49,18.98 0 top
C23  -105,-95 0 top  (outside the outline)
C24  -105,-121 0 top  (outside the outline)
C25  139.6,11.98 0 top
C26  -98,-63 0 top  (outside the outline)
C27  -98,-11 0 top  (outside the outline)
C28  -105,-82 0 top  (outside the outline)
C29  135.29,19.02 180 top
C30  123.02,14.82 90 top
C31  10,-91 90 top  (outside the outline)
C32  -28,-76 90 top  (outside the outline)
C33  -22,173 90 top  (outside the outline)
C34  -44,196 90 top  (outside the outline)
C35  -22,-76 90 top  (outside the outline)
C36  17,-91 90 top  (outside the outline)
C37  -16,-76 90 top  (outside the outline)
C38  -28,173 90 top  (outside the outline)
C39  -240,121 0 top  (outside the outline)
C40  -240,130 0 top  (outside the outline)
C41  -230,129 0 top  (outside the outline)
C42  -10,-76 90 top  (outside the outline)
CY1  87,32 180 top
D1  -198,-202 0 top  (outside the outline)
D2  -198,-239 0 top  (outside the outline)
D3  -198,-260 0 top  (outside the outline)
D4  -198,-281 0 top  (outside the outline)
D5  -189,85 0 top  (outside the outline)
D6  72,69 180 top
D7  78.04,69.24 180 top
D8  -206,-218 0 top  (outside the outline)
D9  -189,68 0 top  (outside the outline)
D10  -189,51 0 top  (outside the outline)
D11  128.4,74.8 0 bottom
D12  -189,34 0 top  (outside the outline)
D13  -197,-179 0 top  (outside the outline)
D14  -101,11 0 top  (outside the outline)
D15  -109,41 0 top  (outside the outline)
D16  -109,35 0 top  (outside the outline)
D17  -145,49 0 top  (outside the outline)
D18  -109,29 0 top  (outside the outline)
D19  -109,23 0 top  (outside the outline)
D20  -101,-224 0 top  (outside the outline)
D21  -101,-181 0 top  (outside the outline)
D22  -83,182 90 top  (outside the outline)
D23  -67,182 90 top  (outside the outline)
IC1  -241,112 0 top  (outside the outline)
J1  -227,58 0 top  (outside the outline)
J2  4.44,12.42 90 bottom
JP1  -210,-158 0 top  (outside the outline)
L1  133.26,39.03 180 top
OK1  17.72,11.62 270 top
PS1  -277,-372 0 top  (outside the outline)
Q1  -96,-288 0 top  (outside the outline)
Q2  -125,59 0 top  (outside the outline)
Q3  2,-127 0 top  (outside the outline)
Q4  62,-30 0 top  (outside the outline)
R1  -214,-295 0 top  (outside the outline)
R2  -280,-7 0 top  (outside the outline)
R3  -200,237 0 top  (outside the outline)
R4  -200,230 0 top  (outside the outline)
R5  -200,216 0 top  (outside the outline)
R6  -200,223 0 top  (outside the outline)
R7  -200,174 0 top  (outside the outline)
R8  -200,167 0 top  (outside the outline)
R9  -200,160 0 top  (outside the outline)
R10  -200,202 0 top  (outside the outline)
R11  -200,153 0 top  (outside the outline)
R12  -200,146 0 top  (outside the outline)
R13  -200,139 0 top  (outside the outline)
R14  -280,14 0 top  (outside the outline)
R15  -280,7 0 top  (outside the outline)
R16  -200,181 0 top  (outside the outline)
R17  -200,188 0 top  (outside the outline)
R18  -200,195 0 top  (outside the outline)
R19  -280,35 0 top  (outside the outline)
R20  -280,42 0 top  (outside the outline)
R21  -280,21 0 top  (outside the outline)
R22  -280,28 0 top  (outside the outline)
R23  -200,209 0 top  (outside the outline)
R24  -101,99 0 top  (outside the outline)
R25  -109,104 0 top  (outside the outline)
R26  -194,103 0 top  (outside the outline)
R27  -200,103 0 top  (outside the outline)
R28  -111,54 0 top  (outside the outline)
R29  -111,-169 0 top  (outside the outline)
R30  150.32,31.2 90 top
R31  -111,47 0 top  (outside the outline)
R32  151.32,16.1 90 top
R33  -110,35 0 top  (outside the outline)
R34  -102,-196 0 top  (outside the outline)
R35  144.32,28.5 90 top
R36  135.95,24.03 0 top
R37  -76,86 0 top  (outside the outline)
R38  9.4,14.5 0 top
R39  -102,-209 0 top  (outside the outline)
R40  127.32,22.9 90 top
R41  -76,67 0 top  (outside the outline)
R42  129.97,11.25 90 top
R43  113.75,22.77 180 top
R44  122.32,27.8 90 top
R45  -280,-329 0 top  (outside the outline)
R46  37,7 90 top
R47  41,9 90 top
R48  -4,-91 90 top  (outside the outline)
R49  -280,-336 0 top  (outside the outline)
R50  46,-34 0 top  (outside the outline)
R51  9,217 0 top  (outside the outline)
R52  3,-91 90 top  (outside the outline)
R53  -45,217 0 top  (outside the outline)
R54  -63,217 0 top  (outside the outline)
STANDOFF1  3,78 0 top
STANDOFF2  3,3 0 top
STANDOFF3  152,3 180 top
STANDOFF4  152,78 0 top
T1  12,-26 0 top  (outside the outline)
T2  12,-65 0 top  (outside the outline)
T3  100.84,13.32 0 top
U1  -16,-89 90 top  (outside the outline)
U2  -131,94 0 top  (outside the outline)
U3  -131,78 0 top  (outside the outline)
U4  -198,119 0 top  (outside the outline)
U5  26,-89 90 top  (outside the outline)
U6  -8,188 90 top  (outside the outline)
U7  -4,-90 0 top  (outside the outline)
U8  0,-110 0 top  (outside the outline)
U9  26,188 90 top  (outside the outline)
U10  47.81,22.29 270 bottom
U11  9,188 90 top  (outside the outline)
U12  -4,-101 0 top  (outside the outline)
U13  0,-118 0 top  (outside the outline)
U14  43,188 90 top  (outside the outline)

### Tracks (layer width: path | path; a pad name or v marks a point on that pad's centre or on a via)
5V  (9 unrouted)
COM  (1 unrouted)
GND  (25 unrouted)
GND1  (7 unrouted)
  Bottom 5.08: L1.CATHODE 115.25,39.03
GND2  (21 unrouted)
I2C_SCL  (2 unrouted)
I2C_SDA  (2 unrouted)
IGND1  (5 unrouted)
LIVE  (4 unrouted)
N$1  (2 unrouted)
  Top 3.81: C10.1 111.92,69.08 116.3,64.7
  Bottom 3.81: 116.3,64.7 112,69 107.78,69 C10.1
N$2  (1 unrouted)
N$3  (1 unrouted)
N$4  (2 unrouted)
N$5  (1 unrouted)
  Top 0.61: R30.2 147.57,39.03 L1.ANODE
  Bottom 5.08: 136.3,53.7 143,47 143,41.27 L1.ANODE
N$6  (8 unrouted)
N$7  (1 unrouted)
N$8  (1 unrouted)
N$9  (3 unrouted)
N$10  (2 unrouted)
N$11  (3 unrouted)
N$12  (1 unrouted)
N$13  (2 unrouted)
N$14  (1 unrouted)
N$15
  Top 0.61: R44.2 121,34.2 121,45 121.53,45.53 L1.SPARKER
N$16  (1 unrouted)
N$17  (1 unrouted)
N$18  (1 unrouted)
N$19  (1 unrouted)
N$20
  Top 0.61: T3.P4 114.89,13 117,13 121.72,12.28 C30.1 123.32,11.98 C25.1 137.83,12.75 C29.1 137.87,18.98 C22.1
N$21  (5 unrouted)
N$22
  Top 0.61: C30.2 123.02,22.02 R44.1 122.27,22.77 R43.1
N$23
  Top 0.61: R40.1 128.81,16.33 R42.2 131.33,16.33 132.75,17.75 C29.2 130.87,20.9 R36.1
N$24
  Top 0.61: R32.1 143.1,11.02 C25.2 144.5,14.34 144.5,23.24 R35.1 141.64,23.42 R36.2
N$25
  Top 0.61: C22.2 149.23,21.18 R32.2 151.32,25.12 R30.1
N$26
  Top 0.61: L1.P2 138.06,33.58 R35.2
N$27  (5 unrouted)
N$28
  Top 0.61: R40.2 129.51,30.17 L1.P1
N$29  (1 unrouted)
N$30  (1 unrouted)
N$31  (1 unrouted)
N$32  (1 unrouted)
N$33  (1 unrouted)
N$34  (5 unrouted)
N$35  (1 unrouted)
N$36  (1 unrouted)
N$37  (2 unrouted)
N$38  (1 unrouted)
N$39  (1 unrouted)
N$40  (10 unrouted)
N$41  (2 unrouted)
N$42  (2 unrouted)
N$43  (5 unrouted)
N$44  (6 unrouted)
N$45  (1 unrouted)
N$46  (1 unrouted)
N$47  (1 unrouted)
N$48  (1 unrouted)
N$49  (1 unrouted)
N$52  (1 unrouted)
N$53  (1 unrouted)
N$54  (1 unrouted)
N$55  (1 unrouted)
N$56  (15 unrouted)
N$57  (1 unrouted)
N$58  (1 unrouted)
N$59  (1 unrouted)
N$60  (2 unrouted)
N$61  (2 unrouted)
N$62  (1 unrouted)
N$63  (1 unrouted)
N$64  (1 unrouted)
N$65  (2 unrouted)
N$66  (1 unrouted)
N$67  (2 unrouted)
N$68  (2 unrouted)
N$69  (1 unrouted)
N$70  (1 unrouted)
N$71  (1 unrouted)
N$72  (1 unrouted)
N$73  (1 unrouted)
N$74  (10 unrouted)
N$75  (2 unrouted)
N$76  (2 unrouted)
N$77  (1 unrouted)
N$78  (1 unrouted)
N$79  (1 unrouted)
N$80  (1 unrouted)
N$81  (1 unrouted)
N$82  (1 unrouted)
N$83  (1 unrouted)
NEUTRAL  (5 unrouted)
T_CHARGE  (2 unrouted)
T_DONE  (2 unrouted)
T_FAULT  (2 unrouted)
T_TRIGGER  (1 unrouted)
TR_GND  (9 unrouted)
VDD  (11 unrouted)
VGH  (7 unrouted)
VMAIN*2/4  (4 unrouted)
VTRG  (1 unrouted)